# EAGLE schematic Clock Multiplexer (EAGLE 7.6.0)
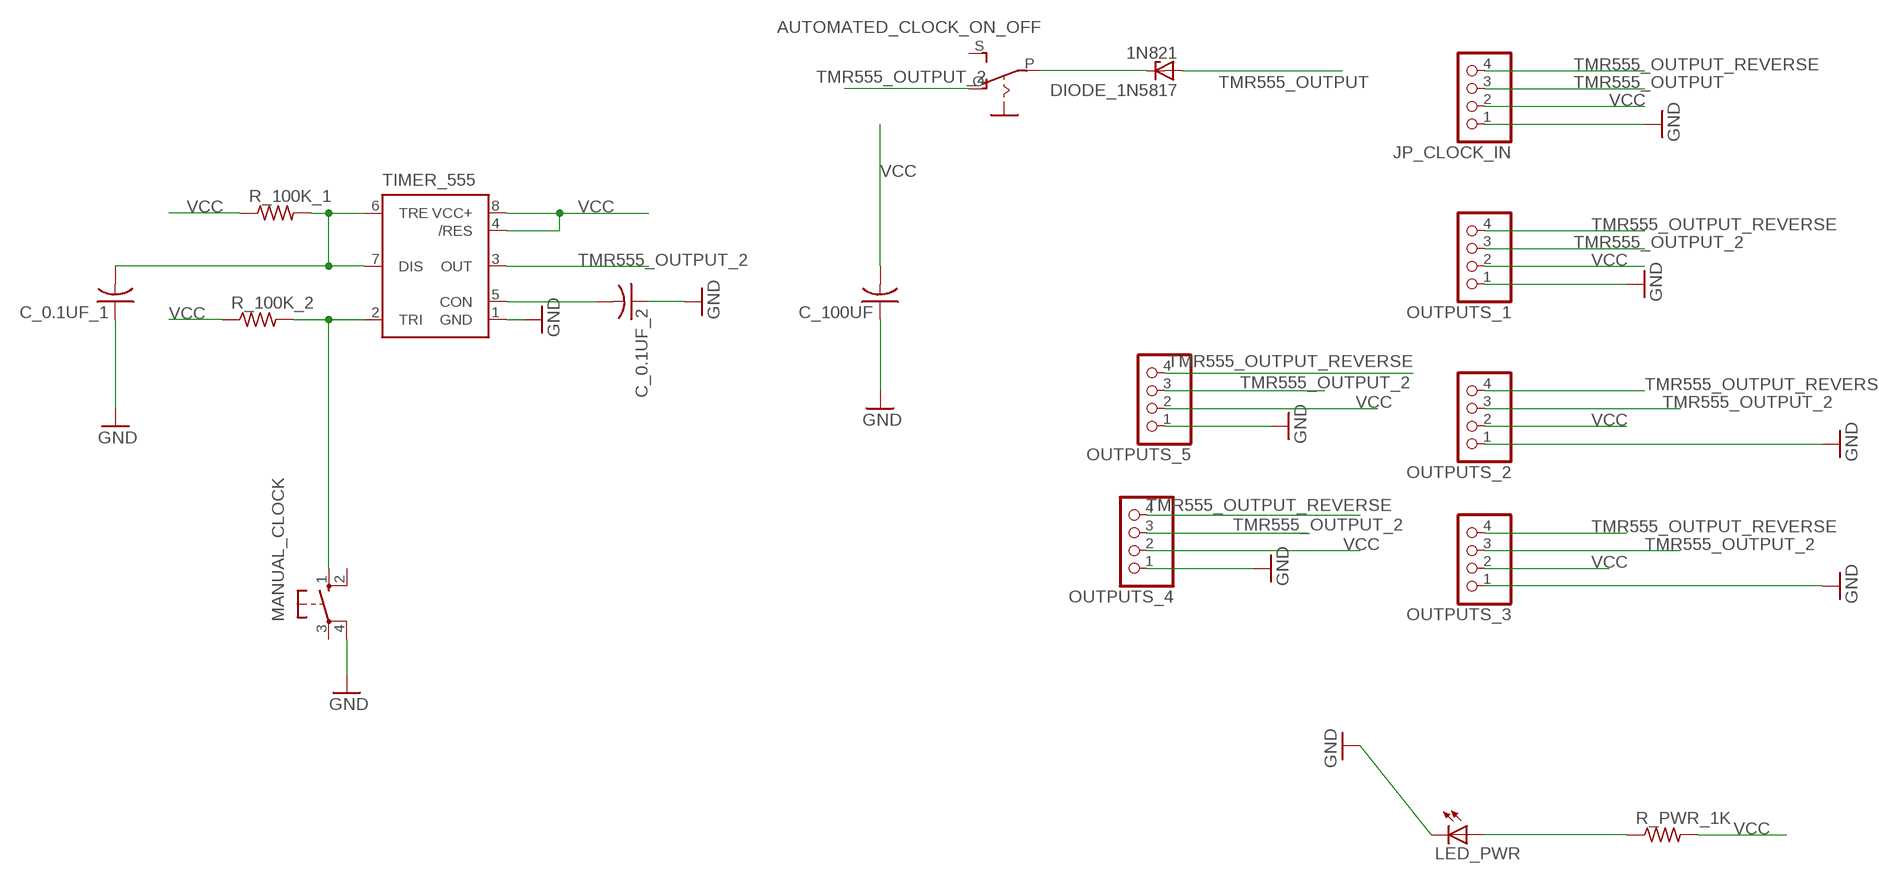
[diagram p0: schematic, sheet 1]

## Parts
AUTOMATED_CLOCK_ON_OFF  EG1218S  [EG1218]
C_0.1UF_1  C-USC1206  [C1206]
C_0.1UF_2  C-USC1206  [C1206]
C_100UF  C-US025-030X050  [C025-030X050]
DIODE_1N5817  1N821  [DO35Z10]
JP_CLOCK_IN  PINHD-1X4  [1X04]
LED_PWR  LEDSMT1206  [1206]
MANUAL_CLOCK  10-XX  [B3F-10XX]
OUTPUTS_1  PINHD-1X4  [1X04]
OUTPUTS_2  PINHD-1X4  [1X04]
OUTPUTS_3  PINHD-1X4  [1X04]
OUTPUTS_4  PINHD-1X4  [1X04]
OUTPUTS_5  PINHD-1X4  [1X04]
R_100K_1  R-US_R1206  [R1206]
R_100K_2  R-US_R1206  [R1206]
R_PWR_1K  R-US_R1206  [R1206]
TIMER_555  NE555D  [SO08]

## Nets
GND: C_0.1UF_1.1 C_0.1UF_2.1 C_100UF.1 JP_CLOCK_IN.1 LED_PWR.C MANUAL_CLOCK.4(P1) OUTPUTS_1.1 OUTPUTS_2.1 OUTPUTS_3.1 OUTPUTS_4.1 OUTPUTS_5.1 TIMER_555.1(GND)
N$1: LED_PWR.A R_PWR_1K.1
N$2: AUTOMATED_CLOCK_ON_OFF.P DIODE_1N5817.C
N$3: C_0.1UF_1.2 R_100K_1.2 TIMER_555.6(TRE) TIMER_555.7(DIS)
N$4: C_0.1UF_2.2 TIMER_555.5(CON)
N$5: MANUAL_CLOCK.1(S) R_100K_2.2 TIMER_555.2(TRI)
TMR555_OUTPUT: DIODE_1N5817.A JP_CLOCK_IN.3
TMR555_OUTPUT_2: AUTOMATED_CLOCK_ON_OFF.O OUTPUTS_1.3 OUTPUTS_2.3 OUTPUTS_3.3 OUTPUTS_4.3 OUTPUTS_5.3 TIMER_555.3(OUT)
TMR555_OUTPUT_REVERSE: JP_CLOCK_IN.4 OUTPUTS_1.4 OUTPUTS_2.4 OUTPUTS_3.4 OUTPUTS_4.4 OUTPUTS_5.4
VCC: C_100UF.2 JP_CLOCK_IN.2 OUTPUTS_1.2 OUTPUTS_2.2 OUTPUTS_3.2 OUTPUTS_4.2 OUTPUTS_5.2 R_100K_1.1 R_100K_2.1 R_PWR_1K.2 TIMER_555.4(/RES) TIMER_555.8(VCC+)
Unconnected: AUTOMATED_CLOCK_ON_OFF.S MANUAL_CLOCK.2(S1) MANUAL_CLOCK.3(P)

## Library data of the parts
AUTOMATED_CLOCK_ON_OFF = adafruit:EG1218: SLIDING SWITCH 0.1" spacing through hole, vertical SPDT slide switch http://www.ladyada.net/library/pcb/eaglelibrary.html
C_0.1UF_1 C_0.1UF_2 C_100UF = adafruit:C-US: CAPACITOR, American symbol
DIODE_1N5817 = diode:1N821: Reference DIODE temperature compensated, 6,2 V
JP_CLOCK_IN OUTPUTS_1-OUTPUTS_5 = pinhead:PINHD-1X4: PIN HEADER
LED_PWR = adafruit:LED: LED OSRAM: - CHIPLED LG R971, LG N971, LY N971, LG Q971, LY Q971, LO R971, LY R971 LH N974, LH R974 LS Q976, LO Q976, LY Q976 LO Q996 - Hyper CHIPLED LW Q18S LB Q993, LB Q99A, LB R99A - SideLED LS A670, LO A670, LY A670, LG A670, LP A670 LB A673, LV A673, LT A673, LW A673 LH A674 LY A675 LS A676, LA A676, LO A676, LY A676, LW A676 LS A679, LY A679, LG A679 - Hyper Micro SIDELED® LS Y876, LA Y876, LO Y876, LY Y876 LT Y87S - SmartLED LW L88C, LW L88S LB L89C, LB L89S, LG L890 LS L89K, LO L89K, LY L89K LS L896, LA L896, LO L896, LY L896 - TOPLED LS T670, LO T670, LY T670, LG T670, LP T670 LSG T670, LSP T670, LSY T670, LOP T670, LYG T670 LG T671, LOG T671, LSG T671 LB T673, LV T673, LT T673, LW T673 LH T674 LS T676, LA T676, LO T676, LY T676, LB T676, LH T676, LSB T676, LW T676 LB T67C, LV T67C, LT T67C, LS T67K, LO T67K, LY T67K, LW E67C LS E67B, LA E67B, LO E67B, LY E67B, LB E67C, LV E67C, LT E67C LW T67C LS T679, LY T679, LG T679 LS T770, LO T770, LY T770, LG T770, LP T770 LB T773, LV T773, LT T773, LW T773 LH T774 LS E675, LA E675, LY E675, LS T675 LS T776, LA T776, LO T776, LY T776, LB T776 LHGB T686 LT T68C, LB T68C - Hyper Mini TOPLED® LB M676 - Mini TOPLED Santana® LG M470 LS M47K, LO M47K, LY M47K Source: http://www.osram.convergy.de/
MANUAL_CLOCK = switch-omron:10-XX: OMRON SWITCH; MPN: B3F-1000; OC_FARNELL: 176432; OC_NEWARK: 36M3542
R_100K_1 R_100K_2 R_PWR_1K = adafruit:R-US_: RESISTOR, American symbol
TIMER_555 = SparkFun-AnalogIC:NE555: General purpose bipolar Timer